# EAGLE schematic EvaporometerLite (EAGLE 9.5.2)
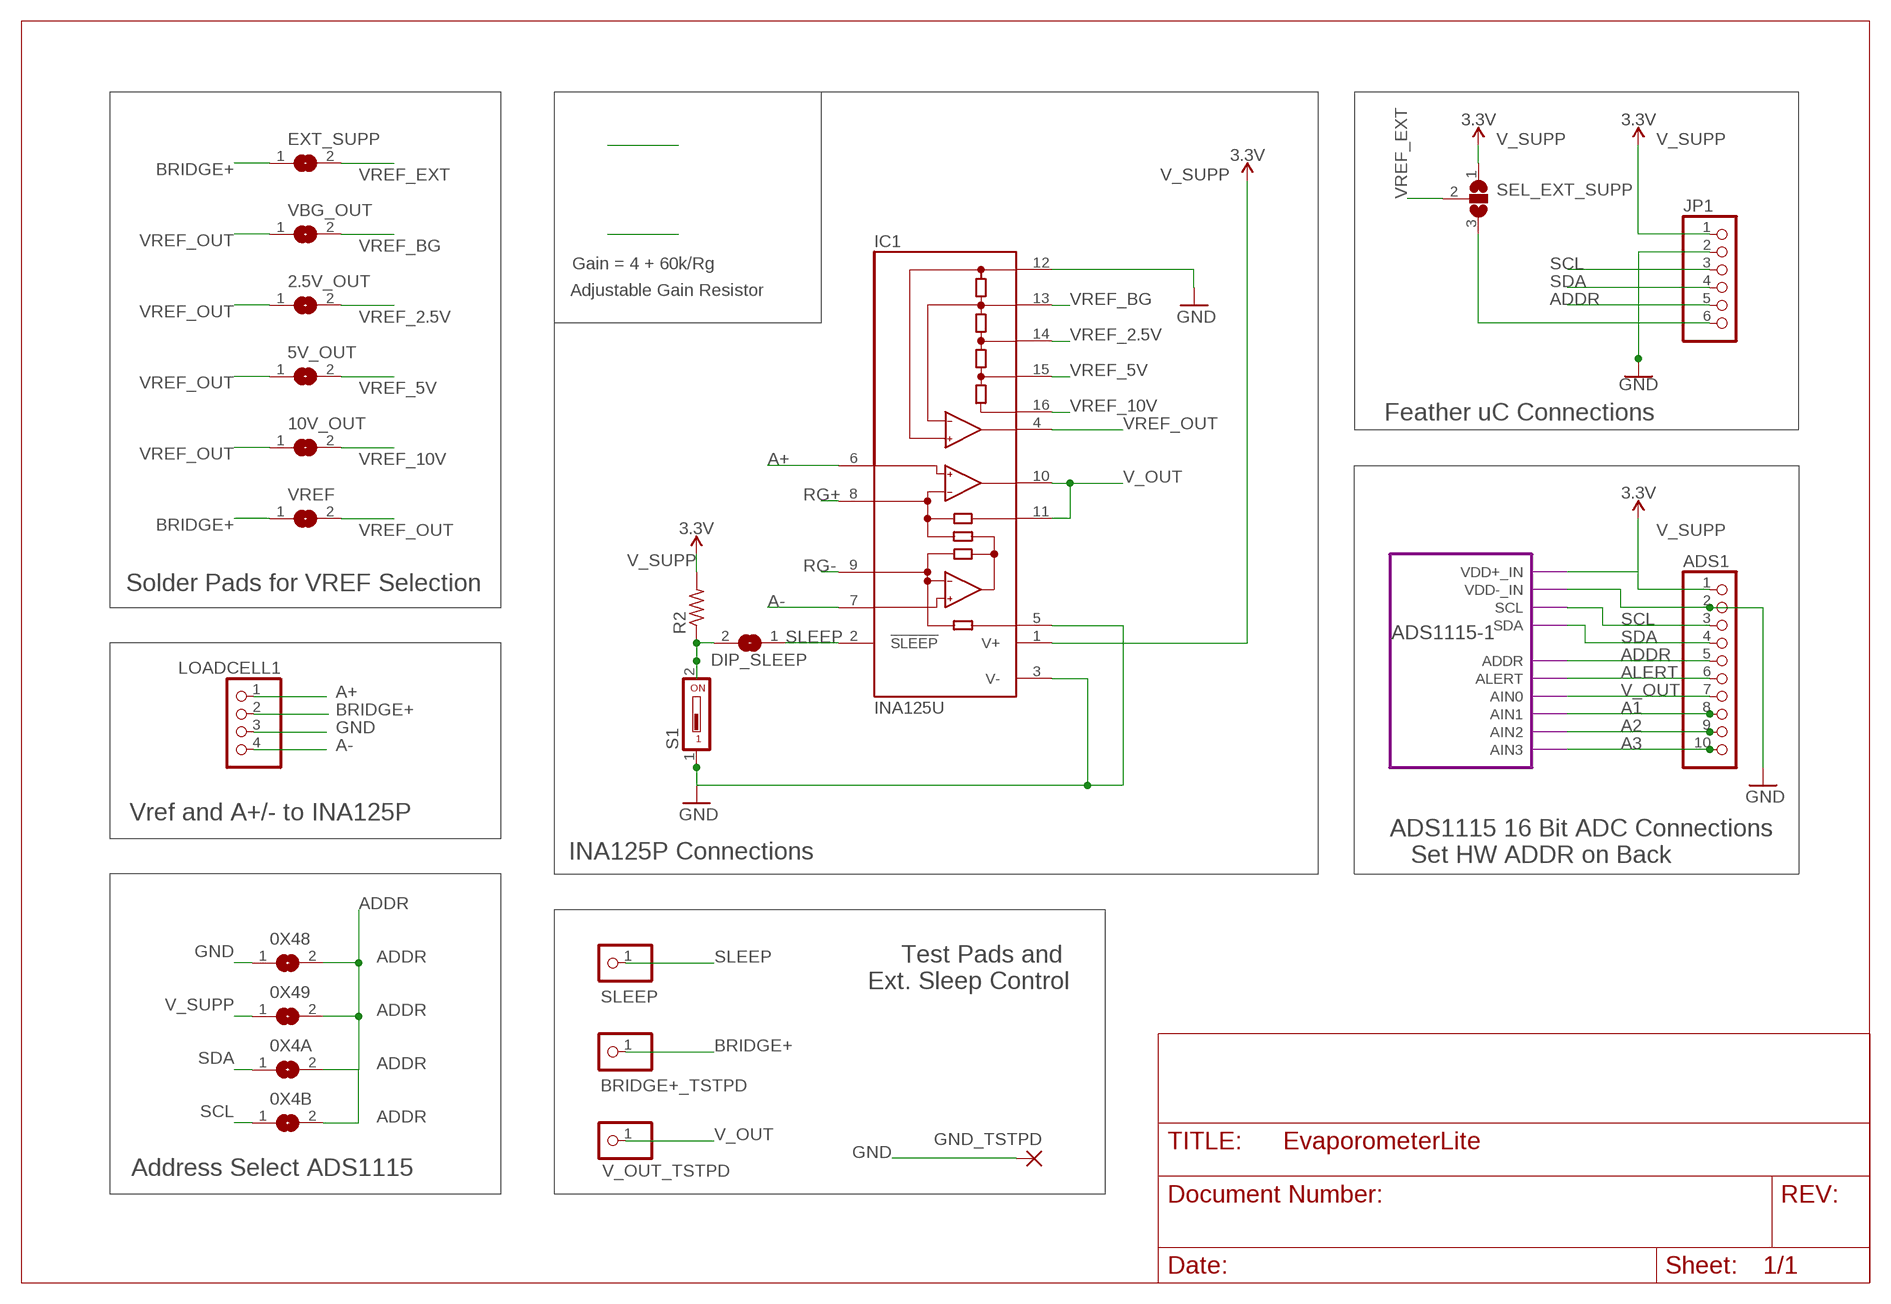
[diagram p0: schematic, sheet 1]

## Parts
0X4A  SJ  [SJ]
0X4B  SJ  [SJ]
0X48  SJ  [SJ]
0X49  SJ  [SJ]
2.5V_OUT  SJ  [SJ]
5V_OUT  SJ  [SJ]
10V_OUT  SJ  [SJ]
ADS1  PINHD-1X10  [1X10]
BRIDGE+_TSTPD  PINHD-1X1  [1X01]
DIP_SLEEP  SJ  [SJ]
EXT_SUPP  SJ  [SJ]
GND_TSTPD  WIREPADSMD2,54-5,08  [SMD2,54-5,08]
IC1  INA125U  [SO16-1]
JP1  PINHD-1X6  [1X06]
LOADCELL1  PINHD-1X4  [1X04]
R2  R-US_R1206  [R1206]
S1  DS01  [DS-01]
SEL_EXT_SUPP  SJ2WW  [SJ_2W]
SLEEP  PINHD-1X1  [1X01]
V_OUT_TSTPD  PINHD-1X1  [1X01]
VBG_OUT  SJ  [SJ]
VREF  SJ  [SJ]

## Module instances
ADS1115-1 = ADS1115

## Nets
A1: ADS1.8 ; port ADS1115-1.AIN1
A2: ADS1.9 ; port ADS1115-1.AIN2
A3: ADS1.10 ; port ADS1115-1.AIN3
A+: IC1.6(+IN) LOADCELL1.1
A-: IC1.7(-IN) LOADCELL1.4
ADDR: 0X4A.2 0X4B.2 0X48.2 0X49.2 ADS1.5 JP1.5 ; port ADS1115-1.ADDR
ALERT: ADS1.6 ; port ADS1115-1.ALERT
BRIDGE+: BRIDGE+_TSTPD.1 EXT_SUPP.1 LOADCELL1.2 VREF.1
GND: 0X48.1 ADS1.2 GND_TSTPD.1(P) IC1.3(V-) IC1.5(REF) IC1.12(REFCOM) JP1.2 LOADCELL1.3 S1.1 ; port ADS1115-1.VDD-_IN
N$16: JP1.6 SEL_EXT_SUPP.3
N$22: DIP_SLEEP.2 R2.1 S1.2
RG+: IC1.8(RG)
RG-: IC1.9(RG)
SCL: 0X4B.1 ADS1.3 JP1.3 ; port ADS1115-1.SCL
SDA: 0X4A.1 ADS1.4 JP1.4 ; port ADS1115-1.SDA
SLEEP: DIP_SLEEP.1 IC1.2(!SLEEP) SLEEP.1
V_OUT: ADS1.7 IC1.10(OUT) IC1.11(SENSE) V_OUT_TSTPD.1 ; port ADS1115-1.AIN0
V_SUPP: 0X49.1 ADS1.1 IC1.1(V+) JP1.1 R2.2 SEL_EXT_SUPP.1 ; port ADS1115-1.VDD+_IN ; supply symbol labelled 3.3V
VREF_2.5V: 2.5V_OUT.2 IC1.14(REF2.5)
VREF_5V: 5V_OUT.2 IC1.15(REF5)
VREF_10V: 10V_OUT.2 IC1.16(REF10)
VREF_BG: IC1.13(REFBG) VBG_OUT.2
VREF_EXT: EXT_SUPP.2 SEL_EXT_SUPP.2
VREF_OUT: 2.5V_OUT.1 5V_OUT.1 10V_OUT.1 IC1.4(REFOUT) VBG_OUT.1 VREF.2

## Notes on the sheet
- Gain = 4 + 60k/Rg
- Adjustable Gain Resistor
- Feather uC Connections
- Solder Pads for VREF Selection
- Vref and A+/- to INA125P
- INA125P Connections
- ADS1115 16 Bit ADC Connections
     Set HW ADDR on Back
- Test Pads and 
  Ext. Sleep Control
- Address Select ADS1115

## Library data of the parts
0X4A 0X4B 0X48 0X49 2.5V_OUT 5V_OUT 10V_OUT DIP_SLEEP EXT_SUPP VBG_OUT VREF = jumper:SJ: SMD solder JUMPER
ADS1 = pinhead:PINHD-1X10: PIN HEADER
BRIDGE+_TSTPD SLEEP V_OUT_TSTPD = pinhead:PINHD-1X1: PIN HEADER
GND_TSTPD = wirepad:WIREPAD: Wire PAD connect wire on PCB
IC1 = burr-brown:INA125: Instrumentation Amplifier with Precision Voltage Reference; MF: TEXAS INSTRUMENT CONNECTORS; MPN: INA125U; OC_FARNELL: 1304375; OC_NEWARK: 80K5901
JP1 = pinhead:PINHD-1X6: PIN HEADER
LOADCELL1 = pinhead:PINHD-1X4: PIN HEADER
R2 = rcl:R-US_: RESISTOR, American symbol; SPICEPREFIX: R
S1 = switch-dil:DS01: DIL/CODE SWITCH; OC_FARNELL: unknown; OC_NEWARK: unknown
SEL_EXT_SUPP = jumper:SJ2W: SMD solder JUMPER

## Module ADS1115
Ports: SCL(io) SDA(io) ADDR(io) ALERT(io) AIN0(io) AIN1(io) AIN2(io) AIN3(io) VDD+_IN(io) VDD-_IN(io)
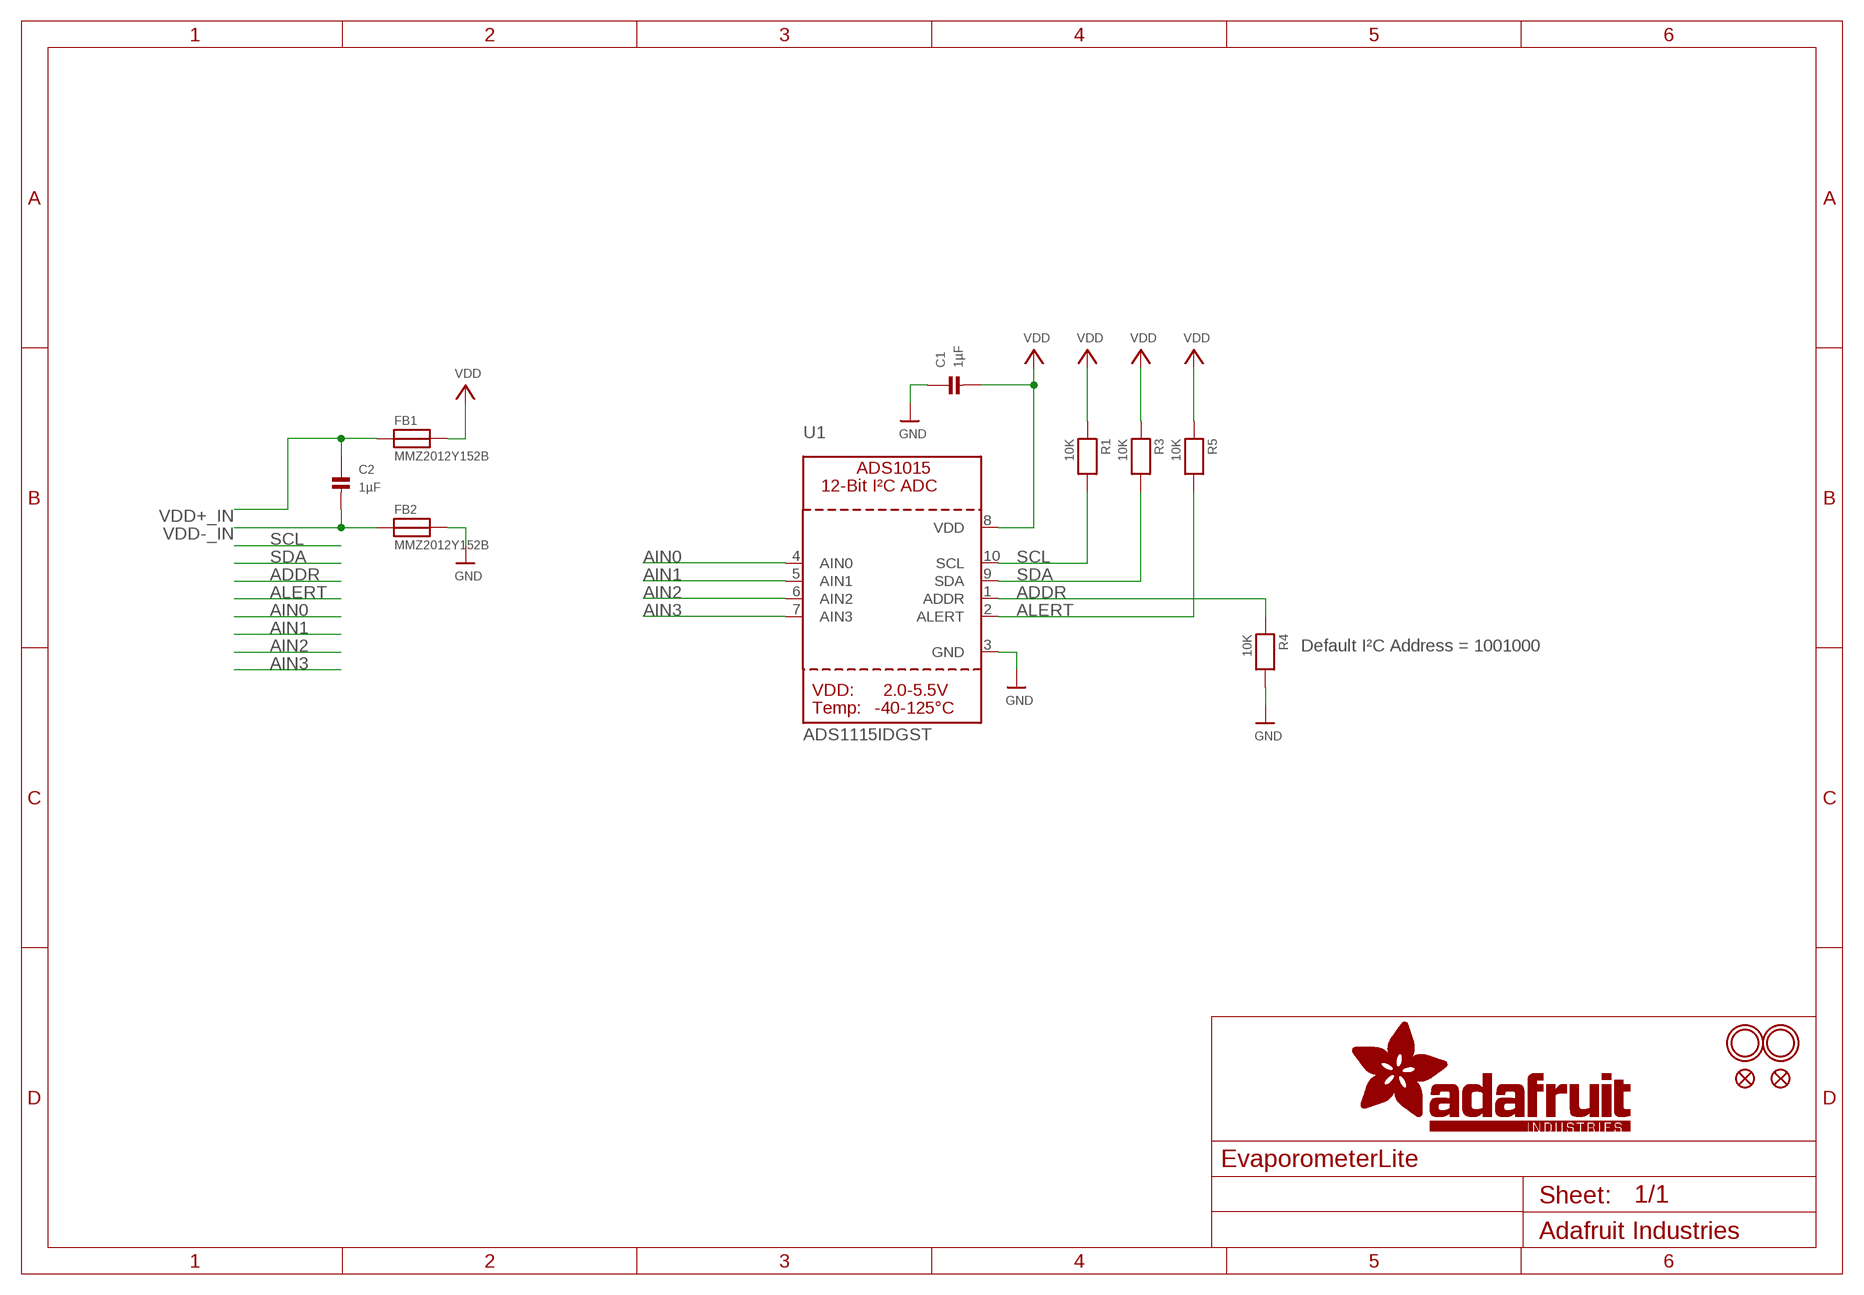
[diagram p1: schematic, module ADS1115, sheet 1]

### Parts
C1  1µF  CAP_CERAMIC0805  [0805]
C2  1µF  CAP_CERAMIC0805  [0805]
FB1  MMZ2012Y152B  FERRITE0805  [0805]
FB2  MMZ2012Y152B  FERRITE0805  [0805]
FID1  FIDUCIAL""  [FIDUCIAL_1MM]
FID2  FIDUCIAL""  [FIDUCIAL_1MM]
R1  10K  RESISTOR0805  [0805]
R3  10K  RESISTOR0805  [0805]
R4  10K  RESISTOR0805  [0805]
R5  10K  RESISTOR0805  [0805]
U1  ADS1115IDGST  ADC_ADS1015  [MSOP10]
U$13  MOUNTINGHOLE2.5  [MOUNTINGHOLE_2.5_PLATED]
U$14  MOUNTINGHOLE2.5  [MOUNTINGHOLE_2.5_PLATED]

### Nets
ADDR: R4.1 U1.1(ADDR)
AIN0: U1.4(AIN0)
AIN1: U1.5(AIN1)
AIN2: U1.6(AIN2)
AIN3: U1.7(AIN3)
ALERT: R5.2 U1.2(ALERT)
GND: C1.1 FB2.2 R4.2 U1.3(GND)
SCL: R1.2 U1.10(SCL)
SDA: R3.2 U1.9(SDA)
VDD: C1.2 FB1.2 R1.1 R3.1 R5.1 U1.8(VDD)
VDD+_IN: C2.1 FB1.1
VDD-_IN: C2.2 FB2.1

### Notes on the sheet
- Default I²C Address = 1001000

### Library data of the parts
C1 C2 = microbuilder:CAP_CERAMIC: Ceramic Capacitors 0402 - 0402 Surface Mount Capacitors 16pF 50V 5% [Digikey: 445-4899-2-ND] 18pF 50V 5% [Digikey: 490-1281-2-ND] 22pF 50V 5% [Digikey: 490-1283-2-ND] 68pF 50V 5% [Digikey: 490-1289-2-ND] 0.1uF 10V 10% [Digikey: 490-1318-2-ND] 1.0uF 6.3V 10% [Digikey: 490-1320-2-ND] 0603 - 0603 Surface Mount Capacitors 16 pF 50V 5% [Digikey: 445-5051-2-ND] 22 pF 50V [Digikey: PCC220ACVTR-ND] 33 pF 50V 5% [Digikey: 490-1415-1-ND] 56pF 50V 5% [Digikey: 490-1421-1-ND] 220pF 50V 5% [Digikey: 445-1285-1-ND] 680 pF 50V 2200 pF 50V 5% C0G [Digikey: 445-1297-1-ND] 5600 pF 100V 5% X7R [Digikey: 478-3711-1-ND] 0.1 µF 25V 10% [Digikey: PCC2277TR-ND] 0.22 µF 16V 10% X7R [Digikey: 445-1318-1-ND] 1.0 µF 25V 10% [Digikey: 445-5146-2-ND] 0603 - RF Specific 3pF 250V +/-0.1pF RF [Digikey: 712-1347-1-ND] 18 pF 250V 5% [Digikey: 478-3505-1-ND or 712-1322-1-ND] 56 pF 250V 5% C0G RF [Digikey: 490-4867-1-ND] 68 pF 250V RF [Digikey: 490-4868-1-ND] 0805 - 0805 Surface Mount Capacitors 220 pF 250V 2% RF Ceramic Capacitor [Digikey: 712-1398-1-ND] 1000 pF 50V 2% NP0 Ceramic Capacitor [Digikey: 478-3760-1-ND] 0.1 µF 25V 10% Ceramic Capacitor [Digikey: PCC1828TR-ND] 1.0 µF 16V 10% Ceramic Capacitor[Digikey: 490-1691-2-ND] 10.0 µF 10V 10% Ceramic Capacitor[Digikey: 709-1228-1-ND] 10.0 uF 16V 10% Ceramic Capacitor [Digikey: 478-5165-2-ND] 47 uF 6.3V 20% Ceramic Capacitor [Digikey: 587-1779-1-ND or 399-5506-1-ND] 1206 - 1206 Surface Mount Capacitors 47uF 10V 20% Ceramic Capacitor [Digikey: 490-5528-1-ND or 399-5508-1-ND or 445-6010-1-ND] 100uF 6.3V -20%, +80% Y5V Ceramic Capacitor (Digikey: 490-4512-1-ND, Mouser: 81-GRM31CF50J107ZE1L)
FB1 FB2 = microbuilder:FERRITE: Ferrite Bead 0603 MMZ1608B121C - 120 Ohm, 600mA Ferrite Chip - Digikey: 445-2164-1-ND BK1608HW121-T - 120 Ohm, 600mA Ferrite Chip - Digikey: 587-1876-2-ND 0805 HZ0805B272R-10 - 2.7K Ohm @ 100MHz, 200mA 0.8 Ohm DC Resistance - Digikey: 240-2504-1-ND (see also Murata BLM21BD272SN1L)
FID1 FID2 = microbuilder:FIDUCIAL: Fiducial Alignment Points Various fiducial points for machine vision alignment.
R1 R3-R5 = microbuilder:RESISTOR: Resistors 0402 - 0402 Surface Mount Package 22 Ohm 1% 1/16W [Digikey: 311-22.0LRTR-ND] 33 Ohm 5% 1/16W 1.0K 5% 1/16W 1.5K 5% 1/16W 2.0K 1% 1/16W 10.0K 1% 1/16W [Digikey: 311-10.0KLRTR-ND] 10.0K 5% 1/16W [Digikey: RMCF0402JT10K0TR-ND] 12.1K 1% 1/16W [Digikey: 311-22.0LRTR-ND] 100.0K 5% 1/16W 0603 - 0603 Surface Mount Package 0 Ohm 1/10 Watt 1% Resistor 15 Ohm 1/10 Watt 1% Resistor 33 Ohm 1/10 Watt 1% Resistor 49.9 Ohm 1/10 Watt 1% Resistor 100 Ohm 1/10 Watt 1% Resistor 150 Ohm 1/10 Watt 1% Resistor 240 Ohm 1/10 Watt 1% Resistor 390 Ohm 1/10 Watt 1% Resistor 560 Ohm 1/10 Watt 1% Resistor 680 Ohm 1/10 Watt 1% Resistor 750 Ohm 1/10 Watt 1% Resistor 1.0K Ohm 1/10 Watt 1% Resistor 1.5K Ohm 1/10 Watt 1% Resistor 2.0K Ohm 1/10 Watt 1% Resistor 2.2K Ohm 1/10 Watt 1% Resistor 3.3K Ohm 1/10 Watt 1% Resistor 4.7K Ohm 1/10 Watt 1% Resistor 10.0K Ohm 1/10 Watt 1% Resistor 12.0K Ohm 1/10 Watt 1% Resistor 12.1K Ohm 1/10 Watt 1% Resistor 20.0K Ohm 1/10 Watt 1% Resistor 33.0K Ohm 1/10 Watt 1% Resistor 100.0K Ohm 1/10 Watt 1% Resistor 0805 - 0805 Surface Mount Package 0 Ohm 1/8 Watt 1% Resistor 33 Ohm 1/8 Watt 1% Resistor 100 Ohm 1/8 Watt 1% Resistor 150 Ohm 1/8 Watt 1% Resistor 200 Ohm 1/8 Watt 1% Resistor 240 Ohm 1/8 Watt 1% Resistor 330 Ohm 1/8 Watt 1% Resistor 390 Ohm 1/8 Watt 1% Resistor 470 Ohm 1/8 Watt 1% Resistor 1.0K Ohm 1/8 Watt 1% Resistor 1.5K Ohm 1/8 Watt 1% Resistor 2.0K Ohm 1/8 Watt 1% Resistor 4.7K Ohm 1/8 Watt 1% Resistor 5.1K Ohm 1/8 Watt 1% Resistor 5.6K Ohm 1/8 Watt 1% Resistor 10.0K Ohm 1/8 Watt 1% Resistor 22.0K Ohm 1/8 Watt 1% Resistor 33.0K Ohm 1/8 Watt 1% Resistor 100K Ohm 1/8 Watt 1% Resistor 1206 - 1206 Surface Mount Package 2012 - 2010 Surface Mount Package 0.11 Ohm 1/2 Watt 1% Resistor - Digikey: RHM.11UCT-ND
U1 = microbuilder:ADC_ADS1015: ADS1015 - 12-bit 4-Channel I2C ADC with Internal PGA VDD: 2.0-5.5V Sampling Rate: 3.3ksps Gain Settings: 2/3, 1, 2, 4, 8, 16 I2C Address: ADDR low = 1001000x, ADDR high = 1001001x Internal Comparator The ADS1015 includes an internal comparator that can be set to output a high-level on ALERT when the conversion results exceeeds a pre-defined upper level, and will deassert itself when the level falls below a pre-defined lower threshold level. It can also be set to windowed mode where the ALERT pin will be asserted if the data exceeds the upper threshold or falls below the lower threshold.
U$13 U$14 = microbuilder:MOUNTINGHOLE: Mounting Hole For #2 screws (0.086"/2.18mm width, 0.094"/2.4mm hole) use 2.5mm